# EAGLE schematic Board V.1+ (EAGLE 7.2.0)
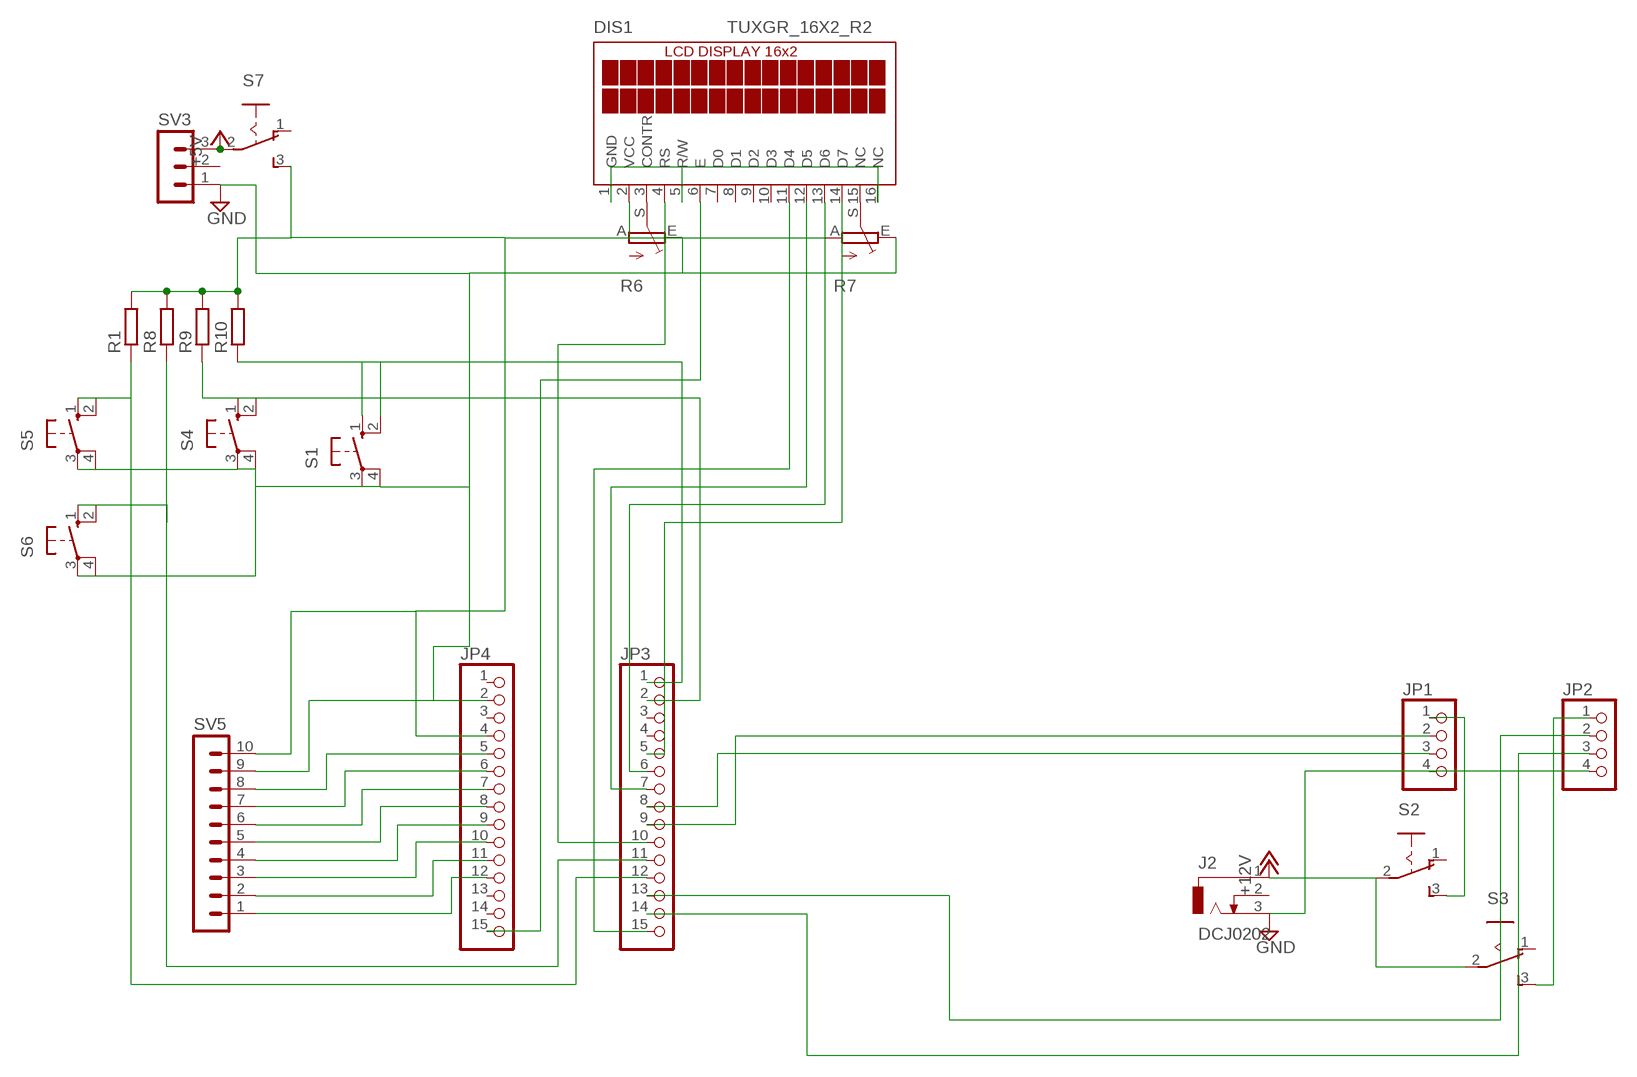
[diagram p0: schematic, sheet 1]

## Parts
DIS1  TUXGR_16X2_R2  [TUXGR_16X2_R2]
J2  DCJ0202  [DCJ0202]
JP1  PINHD-1X4  [1X04]
JP2  PINHD-1X4  [1X04]
JP3  PINHD-1X15  [1X15]
JP4  PINHD-1X15  [1X15]
R1  R-EU_0204/7  [0204/7]
R6  TRIM_EU-B25P  [B25P]
R7  TRIM_EU-B25P  [B25P]
R8  R-EU_0204/7  [0204/7]
R9  R-EU_0204/7  [0204/7]
R10  R-EU_0204/7  [0204/7]
S1  10-XX  [B3F-10XX]
S2  255SB  [255SB]
S3  255SB  [255SB]
S4  10-XX  [B3F-10XX]
S5  10-XX  [B3F-10XX]
S6  10-XX  [B3F-10XX]
S7  255SB  [255SB]
SV3  MA03-1  [MA03-1]
SV5  MA10-1  [MA10-1]

## Nets
+5V: S7.2(P) SV3.3
+5V2: DIS1.2(VCC) JP4.4 R1.2 R6.A R7.A R8.2 R9.2 R10.2 S7.3(S) SV5.10
+12V: J2.1 S2.2(P) S3.2(P)
GND: J2.3 JP1.4 JP2.4 JP4.2 R6.E R7.E S1.3(P) S1.4(P1) S4.3(P) S4.4(P1) S5.3(P) S5.4(P1) S6.3(P) S6.4(P1) SV3.1 SV5.9
N$1: JP1.1 S2.3(S)
N$2: JP2.1 S3.3(S)
N$3: JP1.3 JP3.8
N$4: JP1.2 JP3.9
N$7: JP3.1 R10.1 S1.1(S) S1.2(S1)
N$9: DIS1.15(NC) R7.S
N$10: JP2.2 JP3.13
N$11: DIS1.4(RS) JP3.10
N$13: DIS1.3(CONTR) R6.S
N$14: DIS1.6(E) JP4.15
N$16: DIS1.11(D4) JP3.15
N$23: JP4.5 SV5.8
N$24: JP4.6 SV5.7
N$25: JP4.7 SV5.6
N$26: JP4.8 SV5.5
N$27: JP4.9 SV5.4
N$28: DIS1.12(D5) JP3.7
N$29: DIS1.13(D6) JP3.6
N$30: DIS1.14(D7) JP3.5
N$32: JP3.2 R9.1 S4.1(S) S4.2(S1)
N$33: JP3.11 R8.1 S6.1(S) S6.2(S1)
N$34: JP3.12 R1.1 S5.1(S) S5.2(S1)
N$36: DIS1.1(GND) DIS1.5(R/W) DIS1.16(NC)
N$45: JP2.3 JP3.14
N$46: JP4.10 SV5.3
N$47: JP4.11 SV5.2
N$49: JP4.12 SV5.1
Unconnected: DIS1.7(D0) DIS1.8(D1) DIS1.9(D2) DIS1.10(D3) J2.2 JP3.3 JP3.4 JP4.1 JP4.3 JP4.13 JP4.14 S2.1(O) S3.1(O) S7.1(O) SV3.2

## Library data of the parts
DIS1 = display-lcd:TUXGR_16X2_R2: Tuxgraphics LCD display 16x2 characters reflective, without background light Source: tuxgr_12x2_r2.pdf
J2 = con-jack:DCJ0202: DC POWER JACK Source: DCJ0202.pdf
JP1 JP2 = pinhead:PINHD-1X4: PIN HEADER
JP3 JP4 = pinhead:PINHD-1X15: PIN HEADER
R1 R8-R10 = resistor:R-EU_: RESISTOR, European symbol
R6 R7 = pot:TRIM_EU-: POTENTIOMETER
S1 S4-S6 = switch-omron:10-XX: OMRON SWITCH
S2 S3 S7 = switch:255SB: SLIDING SWITCH Distributor Buerklin, 11G810
SV3 = con-lstb:MA03-1: PIN HEADER
SV5 = con-lstb:MA10-1: PIN HEADER

## Net classes
0 default: width 0.051 mm, clearance 0.051 mm